# Altium schematic sheet CH32V203CCT-WUI-R1-1v0.SchDoc
size 274 x 287 mm; Symbol: Sheet-Symbol_A4; Company: Caesar; Drawed: Caesar; Reviewed: Caesar; Version: V1.0; Page Size: A4; @Project Name: CH32X035G8U6_Multifunctional_Keyboard-1v3-20240412; @Page Count: 1; @Update Date: 2024-04-12; @Create Date: 2024-03-18; @Schematic Name: Schematic1; @Page No: 1; @Page Name: P1; Device: Sheet-Symbol_A4; SheetNumber: 1; SheetTotal: 1
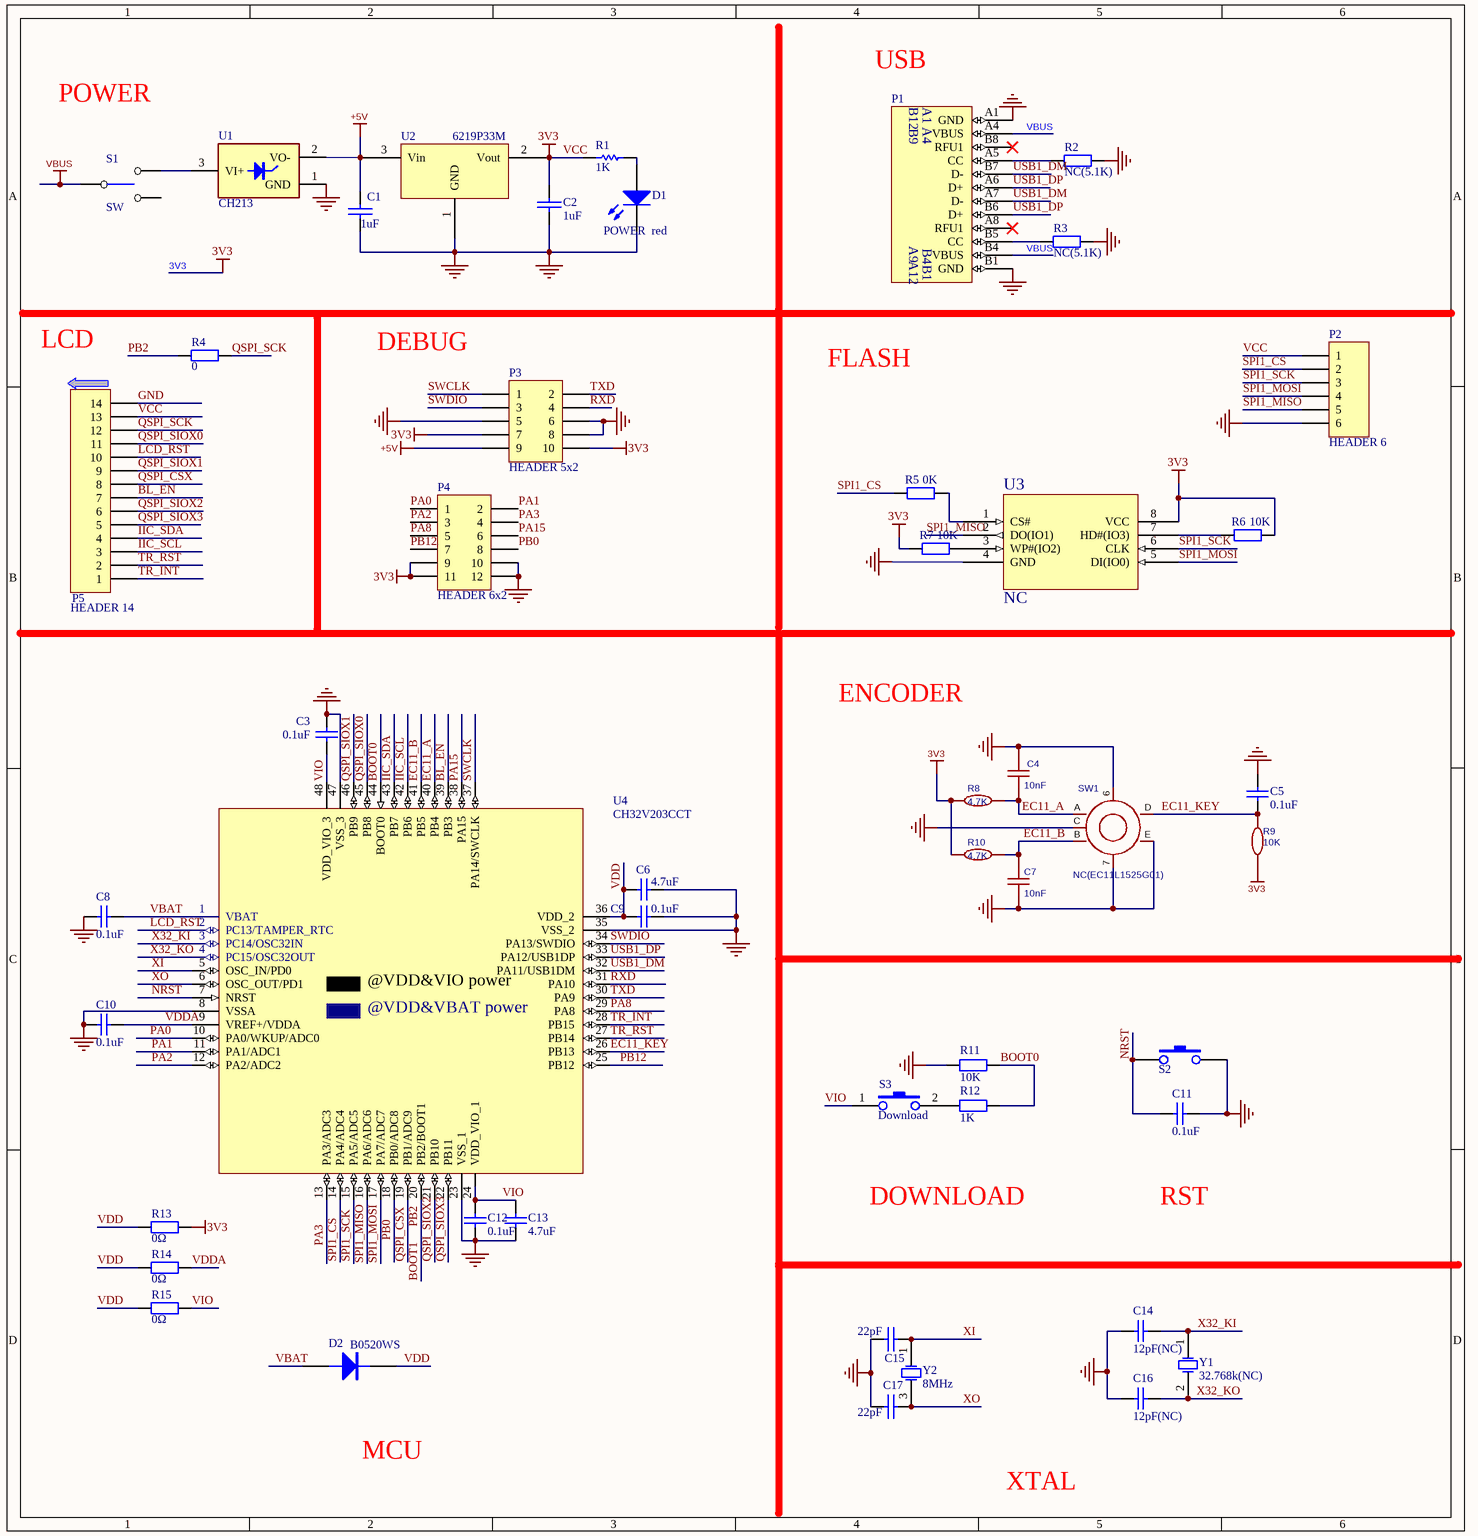
[diagram p0: CH32V203CCT-WUI-R1-1v0.SchDoc]

## Parts
C1  1uF  [0402_C]
C2  1uF  [0402_C]
C3  0.1uF  [0402_C]
C4  10nF  [0402_C]
C5  0.1uF  [0402_C]
C6  4.7uF  [0402_C]
C7  10nF  [0402_C]
C8  0.1uF  [0402_C]
C9  0.1uF  [0402_C]
C10  0.1uF  [0402_C]
C11  0.1uF  [0402_C]
C12  0.1uF  [0402_C]
C13  4.7uF  [0402_C]
C14  12pF(NC)  [0402_C]
C15  22pF  [0402_C]
C16  12pF(NC)  [0402_C]
C17  22pF  [0402_C]
D1  POWER  red  [0603+]
D2  B0520WS  [SOD-323]
P1  TYPE-C  [TYPE-C-Receptacle-2.0]  (value not drawn)
P2  HEADER 6  [SIP6-2.54mm]
P3  HEADER 5x2  [IDC10-2.54mm]
P4  HEADER 6x2  [IDC12-2.54mm]
P5  HEADER 14  [SIP14-2.54mm]
R1  1K  [0402]
R2  NC(5.1K)  [0402]
R3  NC(5.1K)  [0402]
R4  0  [0402]
R5  0K  [0402]
R6  10K  [0402]
R7  10K  [0402]
R8  4.7K  [0402]
R9  10K  [0402]
R10  4.7K  [0402]
R11  10K  [0402]
R12  1K  [0402]
R13  0Ω  [0402]
R14  0Ω  [0402]
R15  0Ω  [0402]
S1  SW  [SW1]
S2  NRST  [贴片按键]  (value not drawn)
S3  Download  [贴片按键]
SW1  NC(EC11L1525G01)  [SW-TH_ALPS_EC11L1525G01]
U1  CH213  [SOT-23-3]
U2  6219P33M  [SOT-23]
U3  NC  [SOIC-8_208mil]
U4  CH32V203CCT  [LQFP48]
Y1  32.768k(NC)  [FC-135]
Y2  8MHz  [XT3225]

## Nets
3V3: C2.1 P2.1 P3.7 P3.10 P4.9 P4.11 P5.13 R1.2 R6.2 R7.1 R8.1 R9.2 R10.1 R13.1 U2.2(Vout) U3.8(VCC)  [also labelled VCC]
+5V: C1.1 P3.9 U1.2(VO-) U2.3(Vin)
GND: C1.2 C2.2 C3.1 C4.2 C5.1 C6.1 C7.2 C8.2 C9.1 C10.2 C11.1 C12.1 C13.2 C14.2 C15.1 C16.2 C17.1 D1.2(K) P1.A1(GND) P1.B1(GND) P2.6 P3.5 P3.6 P3.8 P4.10 P4.12 P5.14 R2.2 R3.2 R11.2 S2.2 SW1.6(EH) SW1.7(EH) SW1.C SW1.E U1.1(GND) U2.1(GND) U3.4(GND) U4.8(VSSA) U4.23(VSS_1) U4.35(VSS_2) U4.47(VSS_3)
VBUS: P1.A4(VBUS) P1.B4(VBUS) S1.1
BL_EN: P5.7 U4.39(PB3)
BOOT0: R11.1 R12.1 U4.44(BOOT0)
BOOT1: R4.1 U4.20(PB2/BOOT1)  [also labelled PB2]
EC11_A: C4.1 R8.2 SW1.A U4.40(PB4)
EC11_B: C7.1 R10.2 SW1.B U4.41(PB5)
EC11_KEY: C5.2 R9.1 SW1.D U4.26(PB13)
IIC_SCL: P5.3 U4.42(PB6)
IIC_SDA: P5.4 U4.43(PB7)
LCD_RST: P5.10 U4.2(PC13/TAMPER_RTC)
NRST: C11.2 S2.1 U4.7(NRST)
PA0: P4.1 U4.10(PA0/WKUP/ADC0)
PA1: P4.2 U4.11(PA1/ADC1)
PA2: P4.3 U4.12(PA2/ADC2)
PA3: P4.4 U4.13(PA3/ADC3)
PA8: P4.5 U4.29(PA8)
PA15: P4.6 U4.38(PA15)
PB0: P4.8 U4.18(PB0/ADC8)
PB12: P4.7 U4.25(PB12)
QSPI_CSX: P5.8 U4.19(PB1/ADC9)
QSPI_SCK: P5.12 R4.2
QSPI_SIOX0: P5.11 U4.45(PB8)
QSPI_SIOX1: P5.9 U4.46(PB9)
QSPI_SIOX2: P5.6 U4.21(PB10)
QSPI_SIOX3: P5.5 U4.22(PB11)
RXD: P3.4 U4.31(PA10)
SPI1_CS: P2.2 R5.1 U4.14(PA4/ADC4)
SPI1_MISO: P2.5 U3.2(DO(IO1)) U4.16(PA6/ADC6)
SPI1_MOSI: P2.4 U3.5(DI(IO0)) U4.17(PA7/ADC7)
SPI1_SCK: P2.3 U3.6(CLK) U4.15(PA5/ADC5)
SWCLK: P3.1 U4.37(PA14/SWCLK)
SWDIO: P3.3 U4.34(PA13/SWDIO)
TR_INT: P5.1 U4.28(PB15)
TR_RST: P5.2 U4.27(PB14)
TXD: P3.2 U4.30(PA9)
USB1_DM: P1.A7(D-) P1.B7(D-) U4.32(PA11/USB1DM)
USB1_DP: P1.A6(D+) P1.B6(D+) U4.33(PA12/USB1DP)
VBAT: C8.1 D2.1(A) U4.1(VBAT)
VDD: C6.2 C9.2 D2.2(K) R13.2 R14.2 R15.2 U4.36(VDD_2)
VDDA: C10.1 R14.1 U4.9(VREF+/VDDA)
VIO: C3.2 C12.2 C13.1 R15.1 S3.1 U4.24(VDD_VIO_1) U4.48(VDD_VIO_3)
X32_KI: C14.1 U4.3(PC14/OSC32IN) Y1.1(OSC1)
X32_KO: C16.1 U4.4(PC15/OSC32OUT) Y1.2(OSC2)
XI: C15.2 U4.5(OSC_IN/PD0) Y2.1(OSC1)
XO: C17.2 U4.6(OSC_OUT/PD1) Y2.3(OSC2)
NetD1_1: D1.1(A) R1.1
NetP1_A5: P1.A5(CC) R2.1
NetP1_B5: P1.B5(CC) R3.1
NetR5_2: R5.2 U3.1(CS#)
NetR6_1: R6.1 U3.7(HD#(IO3))
NetR7_2: R7.2 U3.3(WP#(IO2))
NetR12_2: R12.2 S3.2
NetS1_3: S1.3 U1.3(VI+)

Not connected (* = marked no-connect by the designer): P1 A8(RFU1)* B8(RFU1)*; S1 2

## Notes on the sheet
- USB
- POWER
- LCD
- DEBUG
- FLASH
- ENCODER
- DOWNLOAD
- RST
- MCU
- XTAL
- 更新日期
- 2024-04-12
- 原理图
- 图页
- Schematic1
- P1
- 创建日期
- 物料编码
- 2024-03-18
- 审阅
- 绘制
- Caesar
- CH32X035G8U6_Multifunctional_Keyboard-1v3-20240412
- 版本
- V1.0
- 尺寸
- A4
- 页
- 1
- 共
- (in symbol CH32V203CCT) @VDD&VIO power; @VDD&VBAT power
- (in symbol TYPE-C1) B12; B9; A9; A12

## Library data of the parts
C1 C2 C15 C17 = CAP: Capacitor
C3 C5 C6 C8-C14 C16 = Cap: Capacitor; Published: 8-Jun-2000; LatestRevisionDate: 17-Jul-2002; LatestRevisionNote: Re-released for DXP Platform.; PackageReference: RAD-0.3; Publisher: Altium Limited
  C5 C11: Value: 0.1uF
C4 C7 = CAP_0603: ConvertToPcb: yes; SymbolName: CapAcitance; ModelId: ac125912035d415993ca9572d50418b1; ModelName: C0603_L1.6-W0.8-H0.8; ModelTransform: 62.992,31.496,0,0,0,0,0,0,0; Value: 10nF; Device: CAP_0603; AddInBom: yes; Supplier Footprint: 0603; FootprintName: C0603
D1 = LED0: Typical INFRARED GaAs LED; Published: 8-Jun-2000; LatestRevisionDate: 08-Jul-2005; LatestRevisionNote: Mech Layer 1 removed.; PackageReference: LED-0; Publisher: Altium Limited
D2 = DIODE
P1 = TYPE-C1
P2 = HEADER 6: Header, 6-Pin
P3 = HEADER 5x2: Header, 5-Pin, Dual row
P4 = HEADER 6x2: Header, 6-Pin, Dual row
P5 = HEADER 14: Header, 14-Pin
R1 = Res Semi: Semiconductor Resistor; Published: 8-Jun-2000; LatestRevisionDate: 17-Jul-2002; LatestRevisionNote: Re-released for DXP Platform.; PackageReference: AXIAL-0.5; Publisher: Altium Limited; Value: 1K
R2 R3 R6 R7 R11-R15 = Res2: Resistor
  R6 R7 R11: Published: 8-Jun-2000; LatestRevisionDate: 17-Jul-2002; LatestRevisionNote: Re-released for DXP Platform.; PackageReference: AXIAL-0.4; Publisher: Altium Limited; Value: 10K
  R12: Published: 8-Jun-2000; LatestRevisionDate: 17-Jul-2002; LatestRevisionNote: Re-released for DXP Platform.; PackageReference: AXIAL-0.4; Publisher: Altium Limited
R4 R5 = Res2: Resistor; Value: 10K; Published: 8-Jun-2000; LatestRevisionDate: 17-Jul-2002; LatestRevisionNote: Re-released for DXP Platform.; PackageReference: AXIAL-0.4; Publisher: Altium Limited
R8-R10 = Res_0603: Symbol: 电阻; Value: 5K; ConvertToPcb: yes; ModelId: fc143cca1e79419f9cd78b61e9279f08; ModelName: R0603; ModelTransform: 31.8897,63.7794,0,90,0,0,0,0,0; Device: Res_0603; AddInBom: yes; Supplier Footprint: 0603; FootprintName: R0603
S2 = KEY
S3 = KEY1
SW1 = EC11L1525G01: Manufacturer: ALPSALPINE(阿尔卑斯阿尔派); AddInBom: yes; ModelId: cf33b882906a4832899d48957bbfbd3a; ModelTransform: 515.67818,588.582,0,0,0,0,-0.003,0,-137.795; Symbol: EC11L1525G01; Device: EC11L1525G01; LCSC Part Name: EC11L1525G01; SupplierPart: C2991196; ManufacturerPart: EC11L1525G01; Supplier Footprint: 插件; JLCPCB Part Class: 扩展库; Datasheet: https://atta.szlcsc.com/upload/public/pdf/source/20220411/178C78D91D042177C355D008FA29ADBD.pdf; Supplier: LCSC; ConvertToPcb: yes; FootprintName: SW-TH_ALPS_EC11L1525G01; ModelName: SW-TH_ALPS_EC11L1525G01
U1 = CH213E: Ideal Diode 5V*1A
U3 = W25Q32JV
U4 = CH32V203CCT: RISC-V MCU, 192MHz, USB FS, PIOC, ADC, TKEY, 2*OPA, 2*CMP
Y1 Y2 = XTAL: Crystal Oscillator; Published: 8-Jun-2000; LatestRevisionDate: 17-Jul-2002; LatestRevisionNote: Re-released for DXP Platform.; PackageReference: R38; Publisher: Altium Limited
  Y2: PackageDescription: Crystal, Thru-Hole; 2 Leads; Body 3.1 x 8.2 mm (Dia.xH)